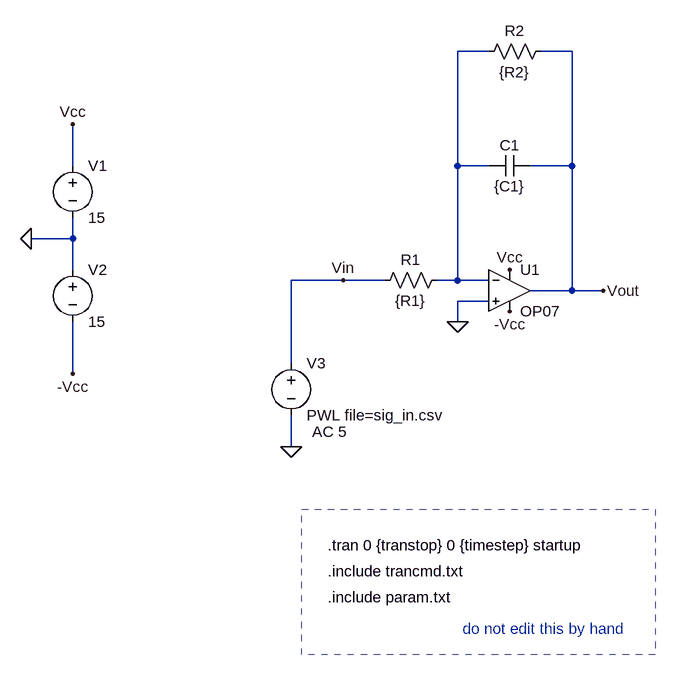
[diagram p0: schematic A1_Baja_1.asc]
A1_Baja_1.asc, the LTspice schematic file:
Version 4
SHEET 1 1180 680
WIRE 160 -432 112 -432
WIRE 288 -432 240 -432
WIRE -480 -256 -480 -320
WIRE 112 -256 112 -432
WIRE 160 -256 112 -256
WIRE 288 -256 288 -432
WIRE 288 -256 224 -256
WIRE -480 -144 -480 -176
WIRE -480 -144 -544 -144
WIRE -480 -96 -480 -144
WIRE -64 -80 -144 -80
WIRE 0 -80 -64 -80
WIRE 112 -80 112 -256
WIRE 112 -80 80 -80
WIRE 160 -80 112 -80
WIRE 288 -64 288 -256
WIRE 288 -64 224 -64
WIRE 336 -64 288 -64
WIRE 160 -48 112 -48
WIRE 112 -16 112 -48
WIRE -144 48 -144 -80
WIRE -480 64 -480 -16
WIRE -144 176 -144 128
FLAG 336 -64 Vout
FLAG 112 -16 0
FLAG -64 -80 Vin
FLAG -544 -144 0
FLAG -480 -320 Vcc
FLAG -480 64 -Vcc
FLAG 192 -96 Vcc
FLAG 192 -32 -Vcc
FLAG -144 176 0
SYMBOL res 96 -96 R90
WINDOW 0 0 56 VBottom 2
WINDOW 3 32 56 VTop 2
SYMATTR InstName R1
SYMATTR Value {R1}
SYMBOL cap 160 -240 R270
WINDOW 0 32 32 VTop 2
WINDOW 3 0 32 VBottom 2
SYMATTR InstName C1
SYMATTR Value {C1}
SYMBOL OpAmps\\OP07 192 -128 R0
SYMATTR InstName U1
SYMBOL voltage -480 -272 R0
WINDOW 123 0 0 Left 0
WINDOW 39 0 0 Left 0
SYMATTR InstName V1
SYMATTR Value 15
SYMBOL voltage -480 -112 R0
WINDOW 123 0 0 Left 0
WINDOW 39 0 0 Left 0
SYMATTR InstName V2
SYMATTR Value 15
SYMBOL voltage -144 32 R0
WINDOW 123 32 121 Left 2
WINDOW 39 0 0 Left 0
SYMATTR Value2 AC 5
SYMATTR InstName V3
SYMATTR Value PWL file=sig_in.csv
SYMBOL res 256 -448 R90
WINDOW 0 0 56 VBottom 2
WINDOW 3 32 56 VTop 2
SYMATTR InstName R2
SYMATTR Value {R2}
TEXT -88 328 Left 2 !.tran 0 {transtop} 0 {timestep} startup
TEXT -88 408 Left 2 !.include param.txt
TEXT -88 368 Left 2 !.include trancmd.txt
TEXT 120 456 Left 2 ;do not edit this by hand
RECTANGLE Normal 416 496 -128 272 2

The netlist it stands for:
* A1_Baja_1.asc
R1 N001 Vin {R1}
C1 N001 Vout {C1}
XU1 0 N001 Vcc -Vcc Vout LT1001  ; OP07, pins In+ In- V+ V- OUT
V1 Vcc 0 15
V2 0 -Vcc 15
V3 Vin 0 PWL file=sig_in.csv AC 5
R2 Vout N001 {R2}
.tran 0 {transtop} 0 {timestep} startup
.include param.txt
.include trancmd.txt
* do not edit this by hand
.lib LTC.lib
.backanno
.end

* Results of the author's LTspice run, read from the files saved beside the schematic
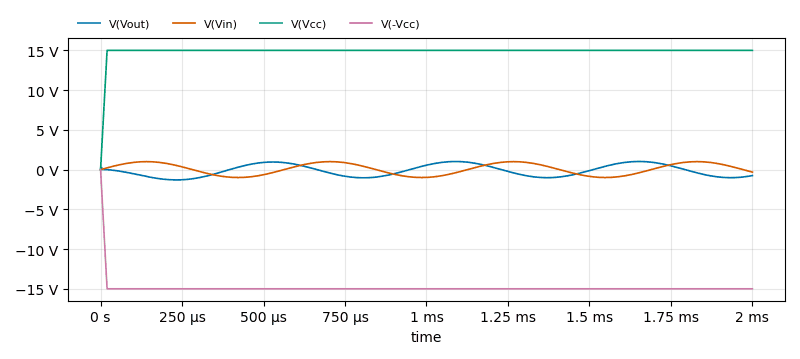
[diagram p1: Transient Analysis of A1_Baja_1.asc, plotted from the saved traces]
* Transient Analysis, 1 run:
*   V(Vout): min -1.301 V, max 1.02 V, average -141.3 mV, rms 752.5 mV, last -753.2 mV
*   V(Vin): min -1 V, max 1 V, average 87.19 mV, rms 701.8 mV, last -319.2 mV
*   V(Vcc): min 0 V, max 15 V, average 14.92 V, rms 14.95 V, last 15 V
*   V(-Vcc): min -15 V, max 0 V, average -14.92 V, rms 14.95 V, last -15 V